# Altium project Power circuit tps63802.PrjPcb
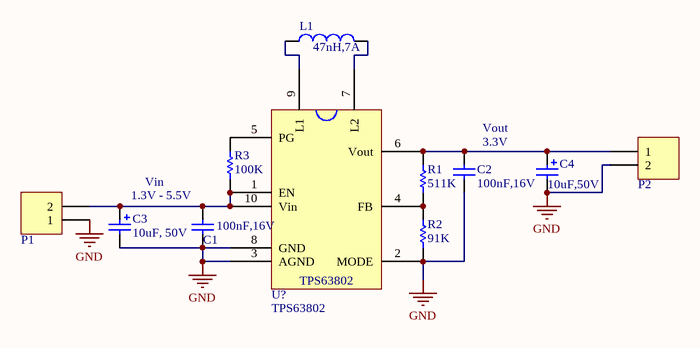
[diagram p0: schematic.SchDoc]
1 sheet, 11 parts. Net scope: global (net labels, ports and power ports of the same name join across sheets).
Board file: PCB1.PcbDoc

## Sheet schematic.SchDoc
size A

### Parts
C1  value 100nF,16V  [CAP-SM-0805]  (hidden comment: Cap Non-Pol SMD)
C2  value 100nF,16V  [CAP-SM-0805]  (hidden comment: Cap Non-Pol SMD)
C3  value 10uF, 50V  [CAP ALU SIZE D]  (hidden comment: Cap Pol SMD)
C4  value 10uF,50V  [CAP ALU SIZE D]  (hidden comment: Cap Pol SMD)
L1  value 47nH,7A  [INDUCTOR 12.5x12.5]  (hidden comment: Inductor)
P1  Domino 2  [DOMINO 2- 5mm]  (value not drawn)
P2  Domino 2  [DOMINO 2- 5mm]  (value not drawn)
R1  value 511K  [RES-SM-0603]  (hidden comment: RESISTOR SMD)
R2  value 91K  [RES-SM-0603]  (hidden comment: RESISTOR SMD)
R3  value 100K  [RES-SM-0603]  (hidden comment: RESISTOR SMD)
U?  TPS63802  [SON50P200X100-10N]

### Nets
GND: C1.1 C2.1 C3.2 C4.2 P1.1 P2.2 R2.1 U?.2(MODE) U?.3(AGND) U?.8(GND)
NetC1_2: C1.2 C3.1 P1.2 R3.1 U?.1(EN) U?.10(Vin)
NetC2_2: C2.2 C4.1 P2.1 R1.2 U?.6(Vout)
NetL1_1: L1.1 U?.9(L1)
NetL1_2: L1.2 U?.7(L2)
NetR1_1: R1.1 R2.2 U?.4(FB)
NetR3_2: R3.2 U?.5(PG)

### Notes on the sheet
- Vout
- 1.3V - 5.5V
- Vin
- (near C2) 3.3V

### Library data of the parts
C1 C2 = Cap Non-Pol SMD: Capacitor
C3 C4 = Cap Pol SMD: Polarized Capacitor (Radial)
P1 P2 = Domino 2: Domino, 2-Pin; LatestRevisionDate: 17-Jul-2002; LatestRevisionNote: Re-released for DXP Platform.; Publisher: Altium Limited
R1-R3 = RESISTOR SMD: Resistor